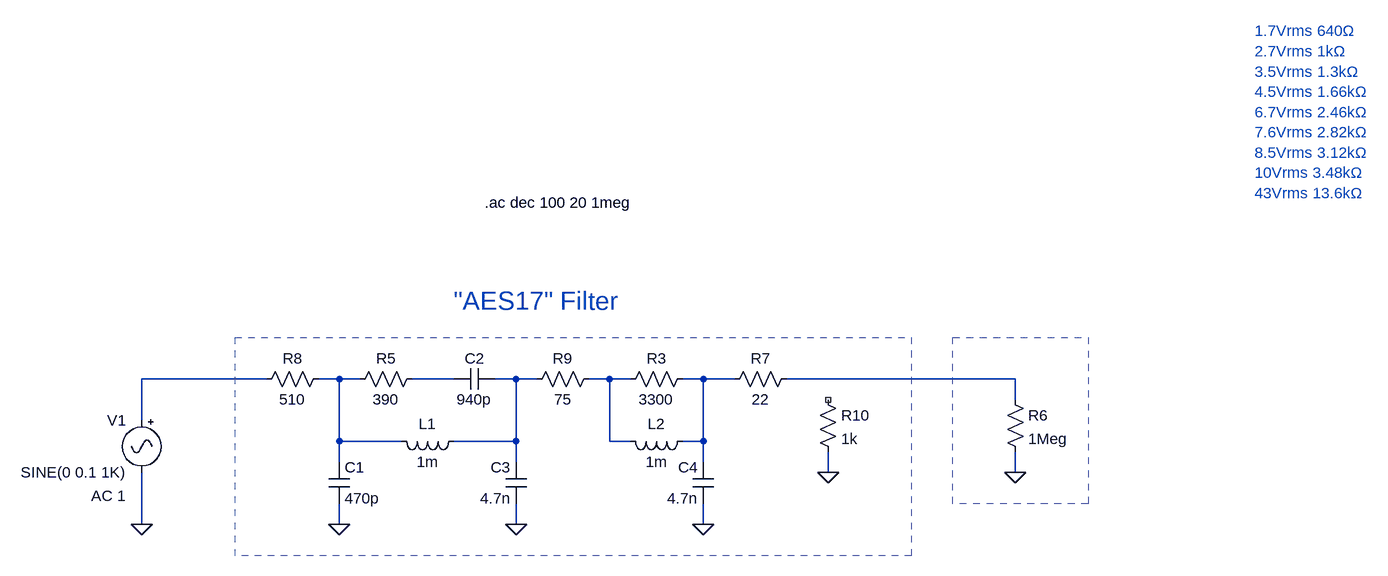
[diagram p0: schematic AES17Filter new only - Frequency.asc]
AES17Filter new only - Frequency.asc, the LTspice schematic file:
Version 4
SHEET 1 2936 680
WIRE 448 -416 256 -416
WIRE 560 -416 528 -416
WIRE 592 -416 560 -416
WIRE 736 -416 672 -416
WIRE 832 -416 800 -416
WIRE 864 -416 832 -416
WIRE 976 -416 944 -416
WIRE 1008 -416 976 -416
WIRE 1120 -416 1088 -416
WIRE 1168 -416 1120 -416
WIRE 1600 -416 1248 -416
WIRE 1600 -384 1600 -416
WIRE 256 -352 256 -416
WIRE 560 -320 560 -416
WIRE 656 -320 560 -320
WIRE 832 -320 832 -416
WIRE 832 -320 736 -320
WIRE 976 -320 976 -416
WIRE 1008 -320 976 -320
WIRE 1120 -320 1120 -416
WIRE 1120 -320 1088 -320
WIRE 560 -288 560 -320
WIRE 832 -288 832 -320
WIRE 1120 -288 1120 -320
WIRE 1312 -272 1312 -304
WIRE 1600 -272 1600 -304
WIRE 256 -192 256 -272
WIRE 560 -192 560 -224
WIRE 832 -192 832 -224
WIRE 1120 -192 1120 -224
FLAG 560 -192 0
FLAG 832 -192 0
FLAG 1120 -192 0
FLAG 1600 -272 0
FLAG 1312 -272 0
FLAG 256 -192 0
SYMBOL cap 544 -288 R0
SYMATTR InstName C1
SYMATTR Value 470p
SYMBOL cap 800 -432 R90
WINDOW 0 0 32 VBottom 2
WINDOW 3 32 32 VTop 2
SYMATTR InstName C2
SYMATTR Value 940p
SYMBOL ind 752 -336 R90
WINDOW 0 5 56 VBottom 2
WINDOW 3 32 56 VTop 2
SYMATTR InstName L1
SYMATTR Value 1m
SYMATTR SpiceLine Rser=1.4
SYMBOL cap 848 -224 R180
WINDOW 0 24 56 Left 2
WINDOW 3 24 8 Left 2
SYMATTR InstName C3
SYMATTR Value 4.7n
SYMBOL res 1104 -432 R90
WINDOW 0 0 56 VBottom 2
WINDOW 3 32 56 VTop 2
SYMATTR InstName R3
SYMATTR Value 3300
SYMBOL ind 1104 -336 R90
WINDOW 0 5 56 VBottom 2
WINDOW 3 32 56 VTop 2
SYMATTR InstName L2
SYMATTR Value 1m
SYMATTR SpiceLine Rser=1.4
SYMBOL cap 1136 -224 R180
WINDOW 0 24 56 Left 2
WINDOW 3 24 8 Left 2
SYMATTR InstName C4
SYMATTR Value 4.7n
SYMBOL res 688 -432 R90
WINDOW 0 0 56 VBottom 2
WINDOW 3 32 56 VTop 2
SYMATTR InstName R5
SYMATTR Value 390
SYMBOL res 1584 -400 R0
SYMATTR InstName R6
SYMATTR Value 1Meg
SYMBOL res 1264 -432 R90
WINDOW 0 0 56 VBottom 2
WINDOW 3 32 56 VTop 2
SYMATTR InstName R7
SYMATTR Value 22
SYMBOL res 544 -432 R90
WINDOW 0 0 56 VBottom 2
WINDOW 3 32 56 VTop 2
SYMATTR InstName R8
SYMATTR Value 510
SYMBOL res 960 -432 R90
WINDOW 0 0 56 VBottom 2
WINDOW 3 32 56 VTop 2
SYMATTR InstName R9
SYMATTR Value 75
SYMBOL res 1296 -400 R0
SYMATTR InstName R10
SYMATTR Value 1k
SYMBOL Misc\\signal 256 -368 M0
WINDOW 123 24 132 Left 2
WINDOW 39 0 0 Left 0
SYMATTR Value2 AC 1
SYMATTR InstName V1
SYMATTR Value SINE(0 0.1 1K)
TEXT 784 -688 Left 2 !.ac dec 100 20 1meg
TEXT 1968 -952 Left 2 ;1.7Vrms 640Ω\n2.7Vrms 1kΩ\n3.5Vrms 1.3kΩ\n4.5Vrms 1.66kΩ\n6.7Vrms 2.46kΩ\n7.6Vrms 2.82kΩ\n8.5Vrms 3.12kΩ\n10Vrms 3.48kΩ\n43Vrms 13.6kΩ
TEXT 736 -536 Left 4 ;"AES17" Filter
RECTANGLE Normal 1440 -144 400 -480 2
RECTANGLE Normal 1712 -224 1504 -480 2

The netlist it stands for:
* AES17Filter new only - Frequency.asc
C1 N002 0 470p
C2 N004 N003 940p
L1 N004 N002 1m Rser=1.4
C3 0 N004 4.7n
R3 N006 N005 3300
L2 N006 N005 1m Rser=1.4
C4 0 N006 4.7n
R5 N003 N002 390
R6 N007 0 1Meg
R7 N007 N006 22
R8 N002 N001 510
R9 N005 N004 75
R10 NC_01 0 1k
V1 N001 0 SINE(0 0.1 1K) AC 1
.ac dec 100 20 1meg
* 1.7Vrms 640Ω
* 2.7Vrms 1kΩ
* 3.5Vrms 1.3kΩ
* 4.5Vrms 1.66kΩ
* 6.7Vrms 2.46kΩ
* 7.6Vrms 2.82kΩ
* 8.5Vrms 3.12kΩ
* 10Vrms 3.48kΩ
* 43Vrms 13.6kΩ
* "AES17" Filter
.backanno
.end